# Altium schematic sheet FT232.SchDoc
size A4
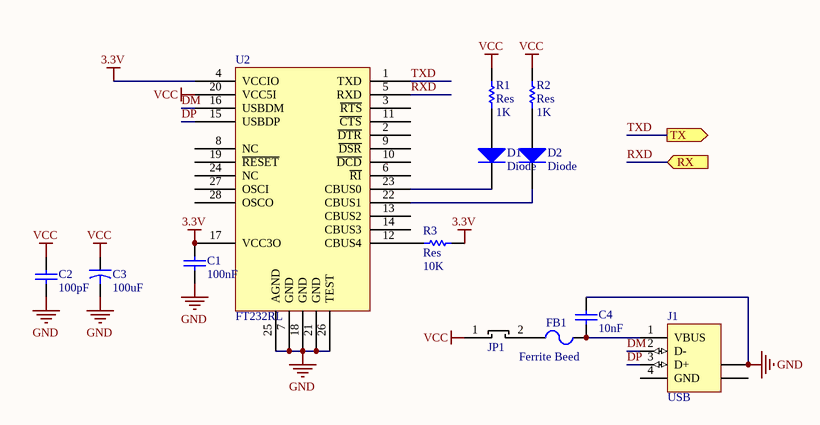
[diagram p0: FT232.SchDoc]

## Parts
C1  value 100nF  [2012[0805]]  (hidden comment: Cap_UP)
C2  value 100pF  [2012[0805]]  (hidden comment: Cap_UP)
C3  value 100uF  [2012[0805]]  (hidden comment: Cap_El)
C4  value 10nF  [2012[0805]]  (hidden comment: Cap_UP)
D1  Diode  [2012[0805]]
D2  Diode  [2012[0805]]
FB1  Ferrite Beed  [2012[0805]]
J1  USB  [USB_MINI]
JP1  JUMPER  [HDR1X2]  (value not drawn)
R1  Res  value 1K  [2012[0805]]
R2  Res  value 1K  [2012[0805]]
R3  Res  value 10K  [2012[0805]]
U2  FT232RL  [SSOP28]

## Ports
RX (in), TX (out)

## Nets
3.3V: C1.2 R3.2 U2.4(VCCIO) U2.17(VCC3O)
GND: C1.1 C2.1 C3.2 C4.1 J1.5(SHLD) U2.7(GND) U2.18(GND) U2.21(GND) U2.25(AGND) U2.26(TEST)
VCC: C2.2 C3.1 JP1.1 R1.2 R2.2 U2.20(VCC5I)
DM: J1.2(D-) U2.16(USBDM)
DP: J1.3(D+) U2.15(USBDP)
RXD: U2.5(RXD) ; port RX
TXD: U2.1(TXD) ; port TX
NetC4_2: C4.2 FB1.2 J1.1(VBUS)
NetD1_1: D1.1(A) R1.1
NetD1_2: D1.2(K) U2.23(CBUS0)
NetD2_1: D2.1(A) R2.1
NetD2_2: D2.2(K) U2.22(CBUS1)
NetFB1_1: FB1.1 JP1.2
NetR3_1: R3.1 U2.12(CBUS4)

Not connected (* = marked no-connect by the designer): J1 4(GND) 6(SHLD); U2 2(~{DTR}) 3(~{RTS}) 6(~{RI}) 8(NC) 9(~{DSR}) 10(~{DCD}) 11(~{CTS}) 13(CBUS2) 14(CBUS3) 19(~{RESET}) 24(NC) 27(OSCI) 28(OSCO)

## Library data of the parts
C1 C2 C4 = Cap_UP: Capacitor; Published: 8-Jun-2000; LatestRevisionDate: 17-Jul-2002; LatestRevisionNote: Re-released for DXP Platform.; PackageReference: RAD-0.3; Publisher: Altium Limited
C3 = Cap_El: Capacitor; Published: 23-Sep-2002; PackageReference: CAPR5-4X5; Publisher: Altium Limited
D1 D2 = Diode: 1 Amp General Purpose Rectifier; Revision 1: 11-Jul-2000: SIM Model Added.; Revision 2: 17-Jul-2002: Re-released for DXP Platform.; Package Information: Latest Revision: Aug-1999; Code - JEDEC: DO-204-AL; Published: 8-Jun-2000; Datasheet: Latest Revision: 1998; Package Reference: DO-41; Publisher: Altium Limited
FB1 = Ferrite Beed: Code_IEC: 1005; Published: 8-Jun-2000; LatestRevisionDate: 17-Jul-2002; LatestRevisionNote: Re-released for DXP Platform.; PackageReference: 0402-A; Publisher: Altium Limited; Code_JEITA: 0402
J1 = USB: USB 1.1, Right Angle, Thru-Hole, A Type, Receptacle, 4 Position, Black; ContactMaterial: Copper Alloy; ContactPlating: Gold (30) over Palladium Nickel; TerminationLength: 2.84mm [0.112in.]; PCB_Layout: Complies with manufacturer's recommendation.; DrillSize: Corresponds to nominal value.; PanelGround: Without; Published: 15-Jul-2004; DatasheetDocument: 11-Jan-2004; PackageDocument: 11-Jan-2004; PackageReference: 1364372; Publisher: Altium Limited; HousingMaterial: Thermoplastic; ComponentLink1Description: Manufacturer Link; ComponentLink1URL: http://www.tycoelectronics.com/; ComponentLink2Description: Packaging Specification; ComponentLink2URL: http://ecommas.tycoelectronics.com/commerce/DocumentDelivery/DDEController?Action=showdoc&DocId=Customer+Drawing%7F1364372%7FD%7Ftif%7FEnglish%7FENG_CD_1364372_D.tif
R1-R3 = Res: Semiconductor Resistor; Published: 8-Jun-2000; LatestRevisionDate: 17-Jul-2002; LatestRevisionNote: Re-released for DXP Platform.; PackageReference: AXIAL-0.5; Publisher: Altium Limited